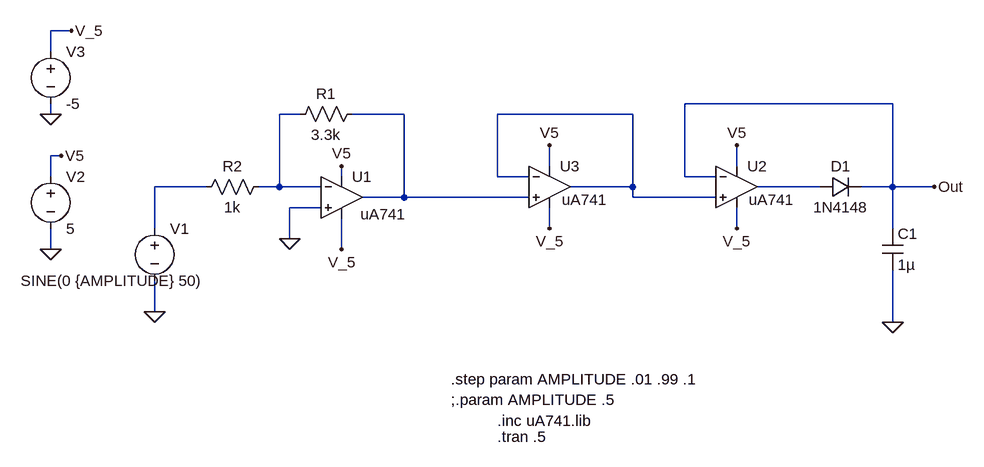
[diagram p0: schematic For-STC013-2.asc]
For-STC013-2.asc, the LTspice schematic file:
Version 4
SHEET 1 1500 680
WIRE 96 -112 64 -112
WIRE 64 -80 64 -112
WIRE 1360 0 1040 0
WIRE 64 16 64 0
WIRE 448 16 416 16
WIRE 608 16 528 16
WIRE 960 16 752 16
WIRE 80 80 64 80
WIRE 832 96 832 64
WIRE 1120 96 1120 64
WIRE 64 112 64 80
WIRE 512 112 512 96
WIRE 752 112 752 16
WIRE 800 112 752 112
WIRE 1040 112 1040 0
WIRE 1088 112 1040 112
WIRE 304 128 224 128
WIRE 416 128 416 16
WIRE 416 128 384 128
WIRE 480 128 416 128
WIRE 960 128 960 16
WIRE 960 128 864 128
WIRE 1248 128 1152 128
WIRE 1360 128 1360 0
WIRE 1360 128 1312 128
WIRE 1424 128 1360 128
WIRE 608 144 608 16
WIRE 608 144 544 144
WIRE 800 144 608 144
WIRE 960 144 960 128
WIRE 1088 144 960 144
WIRE 480 160 432 160
WIRE 224 192 224 128
WIRE 832 192 832 160
WIRE 1120 192 1120 160
WIRE 1360 192 1360 128
WIRE 432 208 432 160
WIRE 64 224 64 192
WIRE 512 224 512 176
WIRE 224 320 224 272
WIRE 1360 336 1360 256
FLAG 224 320 0
FLAG 80 80 V5
FLAG 512 96 V5
FLAG 1424 128 Out
FLAG 1120 64 V5
FLAG 1360 336 0
FLAG 64 224 0
FLAG 64 16 0
FLAG 96 -112 V_5
FLAG 512 224 V_5
FLAG 432 208 0
FLAG 832 64 V5
FLAG 832 192 V_5
FLAG 1120 192 V_5
SYMBOL voltage 224 176 R0
WINDOW 123 0 0 Left 0
WINDOW 39 0 0 Left 0
WINDOW 3 -206 96 Left 2
SYMATTR Value SINE(0 {AMPLITUDE} 50)
SYMATTR InstName V1
SYMBOL voltage 64 96 R0
WINDOW 123 0 0 Left 0
WINDOW 39 0 0 Left 0
SYMATTR InstName V2
SYMATTR Value 5
SYMBOL OpAmps\\UniversalOpAmp 512 144 R0
WINDOW 3 29 26 Left 2
SYMATTR Value uA741
SYMATTR InstName U1
SYMATTR SpiceModel ""
SYMATTR Value2 ""
SYMATTR SpiceLine ""
SYMBOL res 544 0 R90
WINDOW 0 0 56 VBottom 2
WINDOW 3 32 56 VTop 2
SYMATTR InstName R1
SYMATTR Value 3.3k
SYMBOL res 400 112 R90
WINDOW 0 0 56 VBottom 2
WINDOW 3 32 56 VTop 2
SYMATTR InstName R2
SYMATTR Value 1k
SYMBOL OpAmps\\UniversalOpAmp 1120 128 R0
WINDOW 3 19 20 Left 2
SYMATTR Value uA741
SYMATTR InstName U2
SYMATTR SpiceModel ""
SYMBOL diode 1248 144 R270
WINDOW 0 32 32 VTop 2
WINDOW 3 0 32 VBottom 2
SYMATTR InstName D1
SYMATTR Value 1N4148
SYMBOL cap 1344 192 R0
SYMATTR InstName C1
SYMATTR Value 1µ
SYMBOL voltage 64 -96 R0
SYMATTR InstName V3
SYMATTR Value -5
SYMBOL OpAmps\\UniversalOpAmp 832 128 R0
WINDOW 3 19 20 Left 2
SYMATTR Value uA741
SYMATTR InstName U3
SYMATTR SpiceModel ""
TEXT 752 512 Left 2 !.tran .5
TEXT 752 488 Left 2 !.inc uA741.lib
TEXT 680 424 Left 2 !.step param AMPLITUDE .01 .99 .1\n;.param AMPLITUDE .5

The netlist it stands for:
* For-STC013-2.asc
V1 N004 0 SINE(0 {AMPLITUDE} 50)
V2 V5 0 5
XU1 0 N001 V5 V_5 N002 uA741  ; pins In+ In- V+ V- OUT
R1 N002 N001 3.3k
R2 N001 N004 1k
XU2 N003 Out V5 V_5 N005 uA741 Avol=1Meg GBW=10Meg Vos=0 En=0 Enk=0 In=0 Ink=0 Rin=500Meg  ; pins In+ In- V+ V- OUT
D1 N005 Out 1N4148
C1 Out 0 1µ
V3 V_5 0 -5
XU3 N002 N003 V5 V_5 N003 uA741 Avol=1Meg GBW=10Meg Vos=0 En=0 Enk=0 In=0 Ink=0 Rin=500Meg  ; pins In+ In- V+ V- OUT
.model D D
.lib standard.dio
.tran .5
.inc uA741.lib
.step param AMPLITUDE .01 .99 .1
;.param AMPLITUDE .5
.lib UniversalOpAmp1.lib
.backanno
.end